# EasyEDA Pro project CSR8675_Mini_System.eprj

# Schematic Schematic1
Create Date: 2024-04-30; Page Name: P1; Project Name: CSR8675_Mini_System; Schematic Name: Schematic1; Update Date: 2024-04-30; Company: 嘉立创EDA; Page Size: A4; Version: V1.0
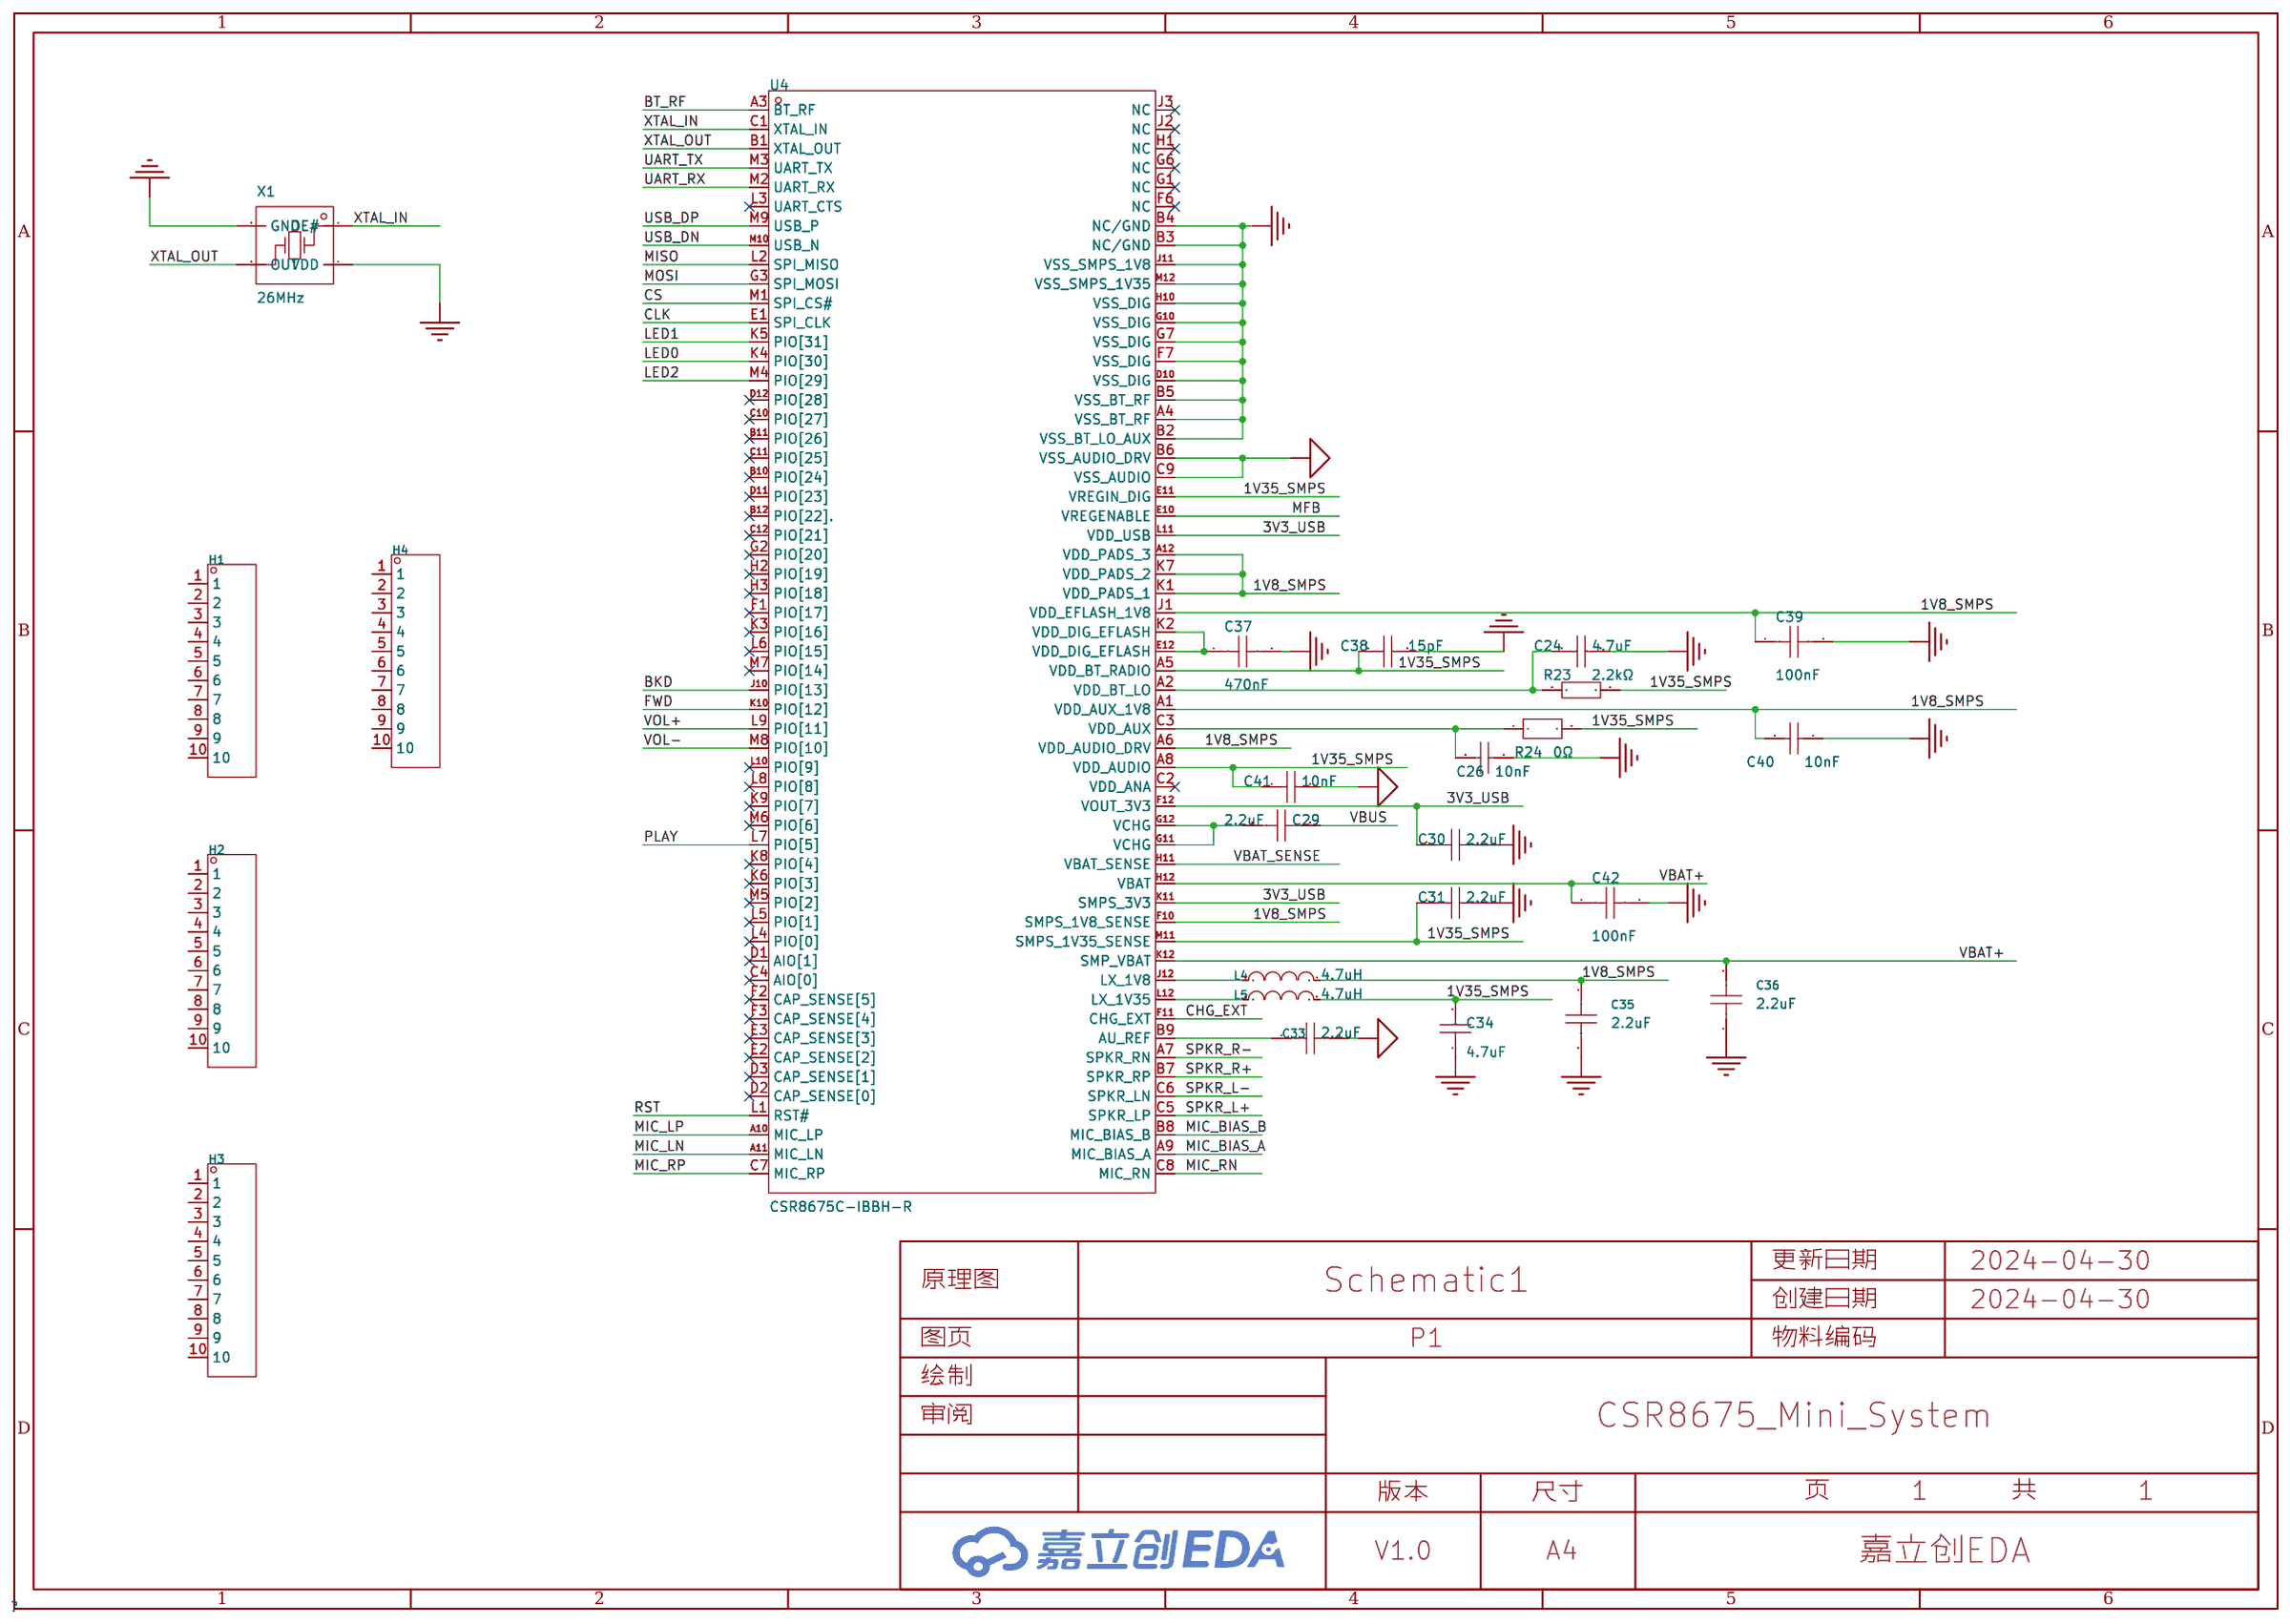
[diagram p0: schematic sheet]

## Parts
C24  4.7uF  [C0603]
C26  10nF  [C0603]
C29  2.2uF  [C0603]
C30  2.2uF  [C0603]
C31  2.2uF  [C0603]
C33  2.2uF  [C0603]
C34  4.7uF  [C0603]
C35  2.2uF  [C0603]
C36  2.2uF  [C0603]
C37  470nF  [C0402]
C38  15pF  [C0402]
C39  100nF  [C0402]
C40  10nF  [C0402]
C41  10nF  [C0402]
C42  100nF  [C0402]
H1  -  [HDR-TH_10P-P2.54-V-M-1]
H2  -  [HDR-TH_10P-P2.54-V-M-1]
H3  -  [HDR-TH_10P-P2.54-V-M-1]
H4  -  [HDR-TH_10P-P2.54-V-M-1]
L4  4.7uH  [L0805]
L5  4.7uH  [L0805]
R23  2.2kΩ  [R0402]
R24  0Ω  [R0402]
U4  CSR8675C-IBBH-R  [BGA-112_L6.5-W6.5-P0.50-TL]
X1  26MHz  [OSC-SMD_4P-L2.0-W1.6-BL_X201624MKB4SI]

## Library data of the parts
C24 = CL10A475KO8NNNC: 容值:4.7uF;精度:±10%;额定电压:16V;材质(温度系数):X5R;; LCSC Part Name: 4.7uF ±10% 16V; Supplier Part: C19666; Manufacturer: SAMSUNG(三星); Supplier Footprint: 0603; JLCPCB Part Class: 基础库; Datasheet: https://atta.szlcsc.com/upload/public/pdf/source/20160218/1457707763339.pdf; Supplier: LCSC; Tolerance: ±10%; Voltage Rated: 16V; Temperature Coefficient: X5R
C26 = CC0603KRX7R9BB103: 容值:10nF;精度:±10%;额定电压:50V;材质(温度系数):X7R;; LCSC Part Name: 10nF ±10% 50V; Supplier Part: C100042; Manufacturer: YAGEO(国巨); Supplier Footprint: 0603; JLCPCB Part Class: 扩展库; Datasheet: https://atta.szlcsc.com/upload/public/pdf/source/20181008/C309510_22F155564471FAF6A489F7D68F34234E.pdf; Supplier: LCSC; Tolerance: ±10%; Voltage Rated: 50V; Temperature Coefficient: X7R
C29-C31 = GRM21BD72A225KE01L: 容值:2.2uF;精度:±10%;额定电压:100V;材质(温度系数):X7T;; LCSC Part Name: 2.2uF ±10% 100V; Supplier Part: C2981733; Manufacturer: muRata(村田); Supplier Footprint: 0805; JLCPCB Part Class: 扩展库; Datasheet: https://atta.szlcsc.com/upload/public/pdf/source/20220321/E617CBC6A636009B84263A7C0F0B7534.pdf; Supplier: LCSC; Tolerance: ±10%; Voltage Rated: 100V; Temperature Coefficient: X7T
C33 C35 C36 = CL10A225KB8NNNC: 容值:2.2uF;精度:±10%;额定电压:50V;材质(温度系数):X5R;; LCSC Part Name: 2.2uF ±10% 50V; Supplier Part: C913904; Manufacturer: SAMSUNG(三星); Supplier Footprint: 0603; JLCPCB Part Class: 扩展库; Datasheet: https://atta.szlcsc.com/upload/public/pdf/source/20160218/1457707763339.pdf; Supplier: LCSC; Tolerance: ±10%; Voltage Rated: 50V; Temperature Coefficient: X5R
C34 = CL21A475KAQNNNE: 容值:4.7uF;精度:±10%;额定电压:25V;材质(温度系数):X5R;; LCSC Part Name: 4.7uF ±10% 25V; Supplier Part: C1779; Manufacturer: SAMSUNG(三星); Supplier Footprint: 0805; JLCPCB Part Class: 基础库; Datasheet: https://atta.szlcsc.com/upload/public/pdf/source/20160218/1457707763339.pdf; Supplier: LCSC; Tolerance: ±10%; Voltage Rated: 25V; Temperature Coefficient: X5R
C37 = GRM155R61H474KE11D: 容值:470nF;精度:±10%;额定电压:50V;材质(温度系数):X5R;; LCSC Part Name: 470nF ±10% 50V; Supplier Part: C437527; Manufacturer: muRata(村田); Supplier Footprint: 0402; JLCPCB Part Class: 扩展库; Datasheet: https://atta.szlcsc.com/upload/public/pdf/source/20191226/C475964_3FAF76C90CD8FFB09F50C7480ADA926F.pdf; Supplier: LCSC; Tolerance: ±10%; Voltage Rated: 50V; Temperature Coefficient: X5R
C38 = 0402CG150J500NT: 容值:15pF;精度:±5%;额定电压:50V;材质(温度系数):C0G;; LCSC Part Name: 15pF ±5% 50V; Supplier Part: C1548; Manufacturer: FH(风华); Supplier Footprint: 0402; JLCPCB Part Class: 基础库; Datasheet: https://atta.szlcsc.com/upload/public/pdf/source/20200305/C486355_26A10D38EF8C2A5C37091D0039909270.pdf; Supplier: LCSC; Tolerance: ±5%; Voltage Rated: 50V; Temperature Coefficient: C0G
C39 C42 = GRM155R71H104KE14D: 容值:100nF;精度:±10%;额定电压:50V;材质(温度系数):X7R;; LCSC Part Name: 100nF ±10% 50V; Supplier Part: C77020; Manufacturer: muRata(村田); Supplier Footprint: 0402; JLCPCB Part Class: 扩展库; Datasheet: https://atta.szlcsc.com/upload/public/pdf/source/20180326/C77020_39BD49C951FF1AF0DB1F1FAC5AC1E401.pdf; Supplier: LCSC; Tolerance: ±10%; Voltage Rated: 50V; Temperature Coefficient: X7R
C40 C41 = CC0402KRX7R9BB103: 容值:10nF;精度:±10%;额定电压:50V;材质(温度系数):X7R;; LCSC Part Name: 10nF ±10% 50V; Supplier Part: C60133; Manufacturer: YAGEO(国巨); Supplier Footprint: 0402; JLCPCB Part Class: 扩展库; Datasheet: https://atta.szlcsc.com/upload/public/pdf/source/20180224/C181747_15194369449651363981.pdf; Supplier: LCSC; Tolerance: ±10%; Voltage Rated: 50V; Temperature Coefficient: X7R
H1-H4 = HDR-M_2.54_1x10P: Supplier Part: C57369; Supplier Footprint: 插件
L4 L5 = LQM21PN4R7MGRD: 电感值:4.7uH;精度:±20%;额定电流:800mA;饱和电流(Isat):-;直流电阻(DCR):288mΩ;; LCSC Part Name: 4.7uH ±20%; Supplier Part: C86090; Manufacturer: muRata(村田); Supplier Footprint: 0805; JLCPCB Part Class: 扩展库; Datasheet: https://atta.szlcsc.com/upload/public/pdf/source/20180326/C86090_F1DCF4677DBA65EF9113FC7328EBFD0F.pdf; Supplier: LCSC; Tolerance: ±20%; Rated Current: 800mA; DC Resistance (DCR): 288mΩ; Frequency - Self Resonant: 30MHz
R23 = 0402WGF2201TCE: 电阻类型:厚膜电阻;阻值:2.2kΩ;精度:±1%;功率:62.5mW;最大工作电压:50V;温度系数:±100ppm/℃;; LCSC Part Name: 2.2kΩ ±1% 62.5mW 厚膜电阻; Supplier Part: C25879; Manufacturer: UNI-ROYAL(厚声); Supplier Footprint: 0402; JLCPCB Part Class: 基础库; Datasheet: https://atta.szlcsc.com/upload/public/pdf/source/20200306/C422600_1E6D84923E4A46A82E41ADD87F860B5C.pdf; Supplier: LCSC; Type: 厚膜电阻; Tolerance: ±1%; Power(Watts): 62.5mW; Overload Voltage (Max): 50V; Temperature Coefficient: ±100ppm/℃; Operating Temperature Range: -55℃~+155℃
R24 = FRC0402F0000TS: 电阻类型:厚膜电阻;阻值:0Ω;精度:±1%;功率:62.5mW;最大工作电压:50V;; LCSC Part Name: 0Ω ±1% 62.5mW 厚膜电阻; Supplier Part: C2906858; Manufacturer: FOJAN(富捷); Supplier Footprint: 0402; JLCPCB Part Class: 扩展库; Datasheet: https://atta.szlcsc.com/upload/public/pdf/source/20211221/925EC7D7225764EE0046F22065062C87.pdf; Supplier: LCSC; Type: 厚膜电阻; Tolerance: ±1%; Power(Watts): 62.5mW; Overload Voltage (Max): 50V; Operating Temperature Range: -55℃~+155℃
U4 = CSR8675C-IBBH-R: 频率范围:2.4GHz;接口:I2S;应用领域:蓝牙;灵敏度:-90dBm;; Supplier Part: C3606593; Manufacturer: Qualcomm; Supplier Footprint: VFBGA-112; JLCPCB Part Class: 扩展库; Supplier: LCSC; Frequency Range: 2.4GHz; Interface: I2S; Operating Voltage: 3.3V; Applications: 蓝牙; Output Power: 10dBm; Sensitivity: -90dBm
X1 = OT201626MJBA4SL: 频率:26MHz;工作电压:1.8V~3.3V;供电电流:4mA;频率稳定度(全温):±10ppm;; LCSC Part Name: 26MHz ±10ppm 1.8V~3.3V YSO110TR; Supplier Part: C669081; Manufacturer: YXC(扬兴晶振); Supplier Footprint: SMD2016-4P; JLCPCB Part Class: 扩展库; Datasheet: https://atta.szlcsc.com/upload/public/pdf/source/20210329/C669065_30B18CFE780D377BA4E84F6ED1951959.pdf; Supplier: LCSC; Supply Voltage: 1.8V~3.3V; Supply Current (Max): 4mA; Frequency Stability(Full temperature range): ±10ppm; Operating Temperature: -40℃~+85℃

## Nets
1V8_SMPS: C35.1 C39.1 C40.1 L4.2 U4.A1(VDD_AUX_1V8) U4.A6(VDD_AUDIO_DRV) U4.A12(VDD_PADS_3) U4.F10(SMPS_1V8_SENSE) U4.J1(VDD_EFLASH_1V8) U4.K1(VDD_PADS_1) U4.K7(VDD_PADS_2)
1V35_SMPS: C31.1 C34.2 C38.1 C41.1 L5.2 R23.2 R24.2 U4.A5(VDD_BT_RADIO) U4.A8(VDD_AUDIO) U4.E11(VREGIN_DIG) U4.M11(SMPS_1V35_SENSE)
3V3_USB: C30.1 U4.F12(VOUT_3V3) U4.K11(SMPS_3V3) U4.L11(VDD_USB)
AGND: C33.2 C41.2 U4.B6(VSS_AUDIO_DRV) U4.C9(VSS_AUDIO)
GND: C24.2 C26.1 C30.2 C31.2 C34.1 C35.2 C36.1 C37.2 C38.2 C39.2 C40.2 C42.2 U4.A4(VSS_BT_RF) U4.B2(VSS_BT_LO_AUX) U4.B3(NC/GND) U4.B4(NC/GND) U4.B5(VSS_BT_RF) U4.D10(VSS_DIG) U4.F7(VSS_DIG) U4.G7(VSS_DIG) U4.G10(VSS_DIG) U4.H10(VSS_DIG) U4.J11(VSS_SMPS_1V8) U4.M12(VSS_SMPS_1V35) X1.2(GND) X1.4(VDD)
VBAT+: C36.2 C42.1 U4.H12(VBAT) U4.K12(SMP_VBAT)
VBAT_SENSE: U4.H11(VBAT_SENSE)
VBUS: C29.2
BKD: U4.J10(PIO[13])
BT_RF: U4.A3(BT_RF)
CHG_EXT: U4.F11(CHG_EXT)
CLK: U4.E1(SPI_CLK)
CS: U4.M1(SPI_CS#)
FWD: U4.K10(PIO[12])
LED0: U4.K4(PIO[30])
LED1: U4.K5(PIO[31])
LED2: U4.M4(PIO[29])
MFB: U4.E10(VREGENABLE)
MIC_BIAS_A: U4.A9(MIC_BIAS_A)
MIC_BIAS_B: U4.B8(MIC_BIAS_B)
MIC_LN: U4.A11(MIC_LN)
MIC_LP: U4.A10(MIC_LP)
MIC_RN: U4.C8(MIC_RN)
MIC_RP: U4.C7(MIC_RP)
MISO: U4.L2(SPI_MISO)
MOSI: U4.G3(SPI_MOSI)
PLAY: U4.L7(PIO[5])
RST: U4.L1(RST#)
SPKR_L+: U4.C5(SPKR_LP)
SPKR_L-: U4.C6(SPKR_LN)
SPKR_R+: U4.B7(SPKR_RP)
SPKR_R-: U4.A7(SPKR_RN)
UART_RX: U4.M2(UART_RX)
UART_TX: U4.M3(UART_TX)
USB_DN: U4.M10(USB_N)
USB_DP: U4.M9(USB_P)
VOL+: U4.L9(PIO[11])
VOL-: U4.M8(PIO[10])
XTAL_IN: U4.C1(XTAL_IN) X1.1(OE#)
XTAL_OUT: U4.B1(XTAL_OUT) X1.3(OUT)
$1N1302: C29.1 U4.G11(VCHG) U4.G12(VCHG)
$1N1310: L4.1 U4.J12(LX_1V8)
$1N1325: C26.2 R24.1 U4.C3(VDD_AUX)
$1N1328: L5.1 U4.L12(LX_1V35)
$1N1332: C24.1 R23.1 U4.A2(VDD_BT_LO)
$1N1345: C37.1 U4.E12(VDD_DIG_EFLASH) U4.K2(VDD_DIG_EFLASH)
$1N1388: C33.1 U4.B9(AU_REF)

Not connected (* = marked no-connect by the designer): H1 1 2 3 4 5 6 7 8 9 10; H2 1 2 3 4 5 6 7 8 9 10; H3 1 2 3 4 5 6 7 8 9 10; H4 1 2 3 4 5 6 7 8 9 10; U4 B10(PIO[24])* B11(PIO[26])* B12(PIO[22].)* C2(VDD_ANA)* C4(AIO[0])* C10(PIO[27])* C11(PIO[25])* C12(PIO[21])* D1(AIO[1])* D2(CAP_SENSE[0])* D3(CAP_SENSE[1])* D11(PIO[23])* D12(PIO[28])* E2(CAP_SENSE[2])* E3(CAP_SENSE[3])* F1(PIO[17])* F2(CAP_SENSE[5])* F3(CAP_SENSE[4])* F6(NC)* G1(NC)* G2(PIO[20])* G6(NC)* H1(NC)* H2(PIO[19])* H3(PIO[18])* J2(NC)* J3(NC)* K3(PIO[16])* K6(PIO[3])* K8(PIO[4])* K9(PIO[7])* L3(UART_CTS)* L4(PIO[0])* L5(PIO[1])* L6(PIO[15])* L8(PIO[8])* L10(PIO[9])* M5(PIO[2])* M6(PIO[6])* M7(PIO[14])*

# Board PCB1
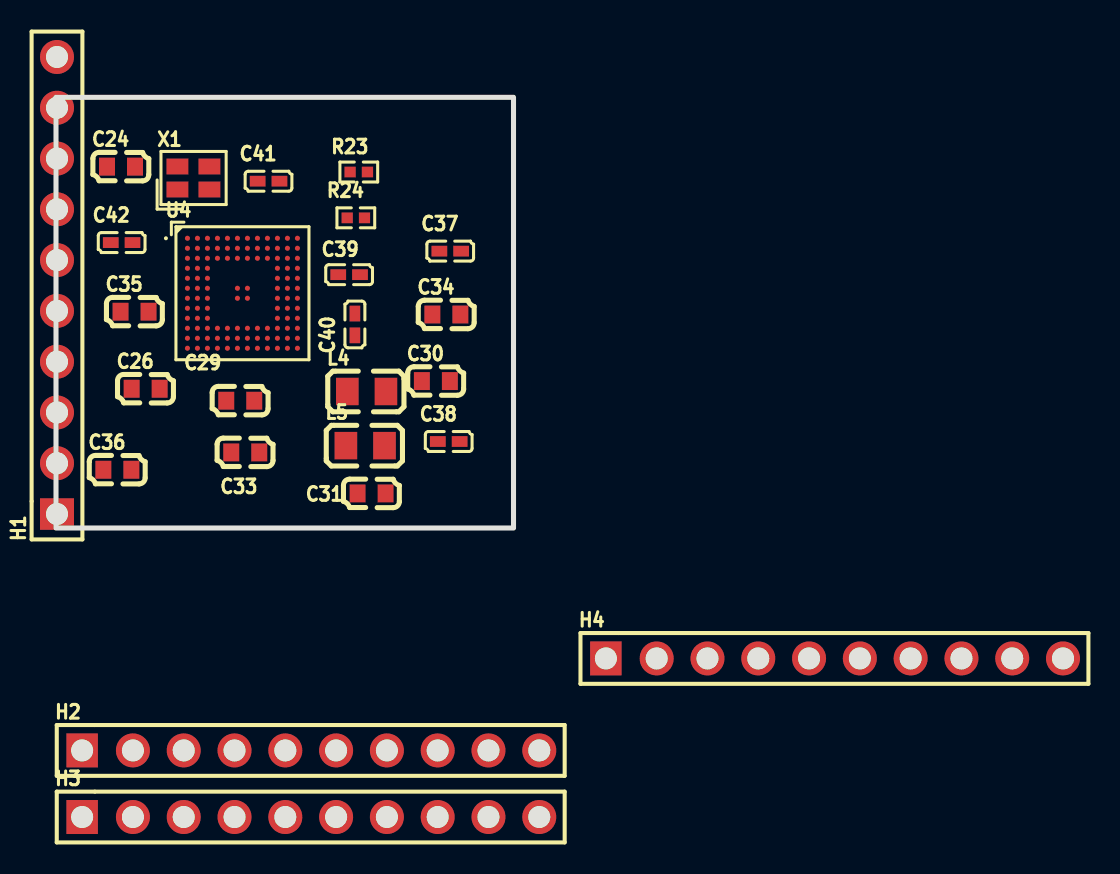
[diagram p1: board, top side]
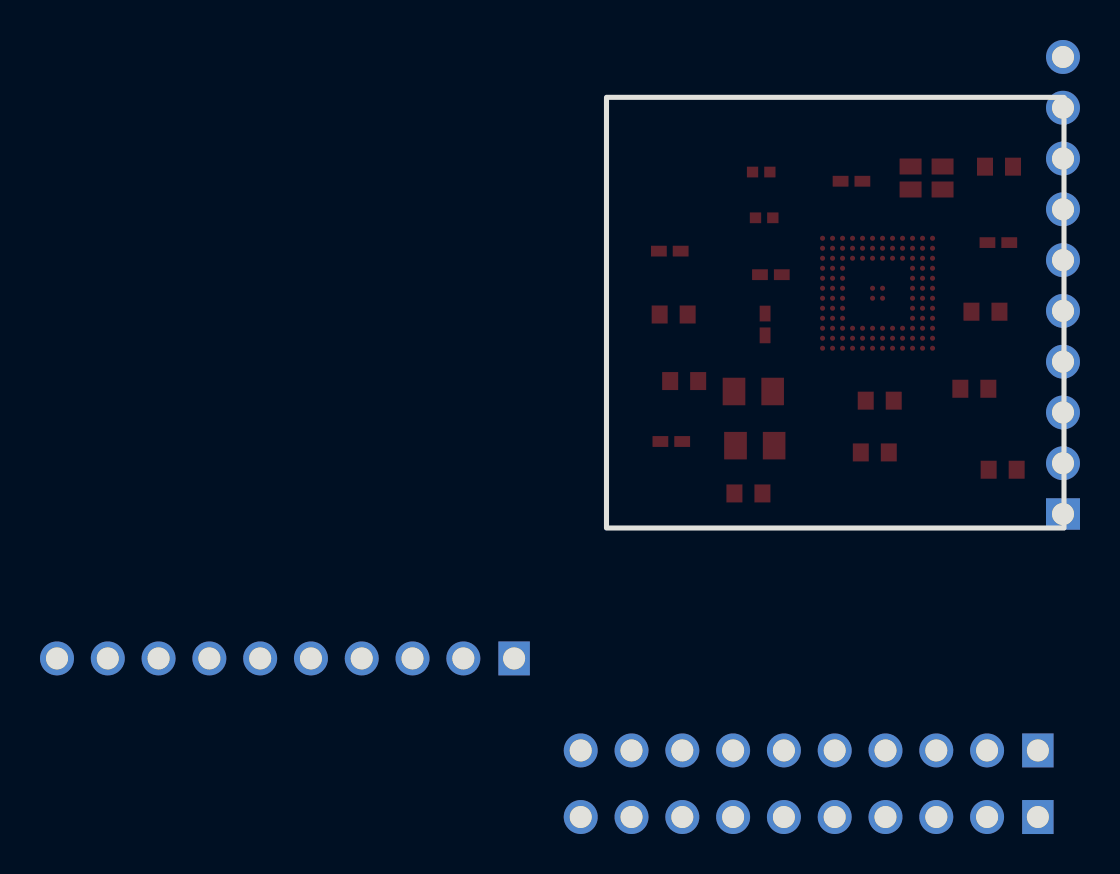
[diagram p2: board, bottom side, seen from below]

Outline 22.88 x 21.54 mm; copper layers: Top Layer, Bottom Layer. Coordinates in mm from the lower left corner of the outline.
Outline path: rectangle 0,21.54 22.88,0
Stack: Top Layer 0.035mm / Dielectric1 1.51mm FR4 er 4.5 / Bottom Layer 0.035mm

## Design rules (mm)
template: JLCPCB Capability(Two Layers Board)
spacing copperThickness1oz (default): track to track 0.102, other pairs 0.152 to 0.3
spacing copperThickness2oz: track to track 0.203, other pairs 0.152 to 0.3
track width copperThickness1oz (default): min 0.127, default 0.254, max 2.54
track width copperThickness2oz: min 0.203, default 0.254, max 2.54
differential pair differentialPair (default): width min 0.127, default 0.254, max 2.54; gap min 0.152, default 0.152
via viaSize (default): diameter min 0.5, default 0.61, max 10; hole min 0.3, default 0.305, max 6.3

## Placement (name value [footprint] x y rotation side)
C24  4.7uF  [C0603]  3.25 18.07 0 top
C26  10nF  [C0603]  4.48 6.96 0 top
C29  2.2uF  [C0603]  9.21 6.37 0 top
C30  2.2uF  [C0603]  18.99 7.35 0 top
C31  2.2uF  [C0603]  15.78 1.73 0 top
C33  2.2uF  [C0603]  9.46 3.78 0 top
C34  4.7uF  [C0603]  19.52 10.68 0 top
C35  2.2uF  [C0603]  3.93 10.82 0 top
C36  2.2uF  [C0603]  3.07 2.91 0 top
C37  470nF  [C0402]  19.71 13.85 0 top
C38  15pF  [C0402]  19.64 4.33 0 top
C39  100nF  [C0402]  14.66 12.67 0 top
C40  10nF  [C0402]  14.95 10.18 90 top
C41  10nF  [C0402]  10.63 17.34 0 top
C42  100nF  [C0402]  3.28 14.28 0 top
H1  -  [HDR-TH_10P-P2.54-V-M-1]  0.05 12.13 90 top
H2  -  [HDR-TH_10P-P2.54-V-M-1]  12.74 -11.13 0 top
H3  -  [HDR-TH_10P-P2.54-V-M-1]  12.74 -14.46 0 top
H4  -  [HDR-TH_10P-P2.54-V-M-1]  38.93 -6.52 0 top
L4  4.7uH  [L0805]  15.54 6.83 0 top
L5  4.7uH  [L0805]  15.46 4.12 0 top
R23  2.2kΩ  [R0402]  15.14 17.8 0 top
R24  0Ω  [R0402]  14.99 15.51 0 top
U4  CSR8675C-IBBH-R  [BGA-112_L6.5-W6.5-P0.50-TL]  9.32 11.74 0 top
X1  26MHz  [OSC-SMD_4P-L2.0-W1.6-BL_X201624MKB4SI]  6.87 17.51 0 top

## Footprints (pads in the part's own frame, mm; a bottom-side part is the same pattern mirrored in y, then rotated)
BGA-112_L6.5-W6.5-P0.50-TL
  round 0.256 smd: A1(-2.75,2.75) A2(-2.25,2.75) A3(-1.75,2.75) A4(-1.25,2.75) A5(-0.75,2.75) A6(-0.25,2.75) A7(0.25,2.75) A8(0.75,2.75) A9(1.25,2.75) A10(1.75,2.75) A11(2.25,2.75) A12(2.75,2.75) B1(-2.75,2.25) B2(-2.25,2.25) B3(-1.75,2.25) B4(-1.25,2.25) B5(-0.75,2.25) B6(-0.25,2.25) B7(0.25,2.25) B8(0.75,2.25) B9(1.25,2.25) B10(1.75,2.25) B11(2.25,2.25) B12(2.75,2.25) C1(-2.75,1.75) C2(-2.25,1.75) C3(-1.75,1.75) C4(-1.25,1.75) C5(-0.75,1.75) C6(-0.25,1.75) C7(0.25,1.75) C8(0.75,1.75) C9(1.25,1.75) C10(1.75,1.75) C11(2.25,1.75) C12(2.75,1.75) D1(-2.75,1.25) D2(-2.25,1.25) D3(-1.75,1.25) D10(1.75,1.25) D11(2.25,1.25) D12(2.75,1.25) E1(-2.75,0.75) E2(-2.25,0.75) E3(-1.75,0.75) E10(1.75,0.75) E11(2.25,0.75) E12(2.75,0.75) F1(-2.75,0.25) F2(-2.25,0.25) F3(-1.75,0.25) F6(-0.25,0.25) F7(0.25,0.25) F10(1.75,0.25) F11(2.25,0.25) F12(2.75,0.25) G1(-2.75,-0.25) G2(-2.25,-0.25) G3(-1.75,-0.25) G6(-0.25,-0.25) G7(0.25,-0.25) G10(1.75,-0.25) G11(2.25,-0.25) G12(2.75,-0.25) H1(-2.75,-0.75) H2(-2.25,-0.75) H3(-1.75,-0.75) H10(1.75,-0.75) H11(2.25,-0.75) H12(2.75,-0.75) J1(-2.75,-1.25) J2(-2.25,-1.25) J3(-1.75,-1.25) J10(1.75,-1.25) J11(2.25,-1.25) J12(2.75,-1.25) K1(-2.75,-1.75) K2(-2.25,-1.75) K3(-1.75,-1.75) K4(-1.25,-1.75) K5(-0.75,-1.75) K6(-0.25,-1.75) K7(0.25,-1.75) K8(0.75,-1.75) K9(1.25,-1.75) K10(1.75,-1.75) K11(2.25,-1.75) K12(2.75,-1.75) L1(-2.75,-2.25) L2(-2.25,-2.25) L3(-1.75,-2.25) L4(-1.25,-2.25) L5(-0.75,-2.25) L6(-0.25,-2.25) L7(0.25,-2.25) L8(0.75,-2.25) L9(1.25,-2.25) L10(1.75,-2.25) L11(2.25,-2.25) L12(2.75,-2.25) M1(-2.75,-2.75) M2(-2.25,-2.75) M3(-1.75,-2.75) M4(-1.25,-2.75) M5(-0.75,-2.75) M6(-0.25,-2.75) M7(0.25,-2.75) M8(0.75,-2.75) M9(1.25,-2.75) M10(1.75,-2.75) M11(2.25,-2.75) M12(2.75,-2.75)
C0402
  rect 0.79x0.54 smd: 1(-0.545,0) 2(0.545,0)
C0603
  rect 0.8x0.9 smd: 1(-0.7,0) 2(0.7,0)
HDR-TH_10P-P2.54-V-M-1
  rect 1.575x1.7 hole 1.1: 1(-11.43,0)
  round 1.7 hole 1.1: 2(-8.89,0) 3(-6.35,0) 4(-3.81,0) 5(-1.27,0) 6(1.27,0) 7(3.81,0) 8(6.35,0) 9(8.89,0) 10(11.43,0)
L0805
  rect 1.133x1.377 smd: 1(-0.966,0) 2(0.966,0)
OSC-SMD_4P-L2.0-W1.6-BL_X201624MKB4SI
  rect 1.1x0.8 smd: 1(-0.8,-0.575) 2(0.8,-0.575) 3(0.8,0.575) 4(-0.8,0.575)
R0402
  rect 0.566x0.54 smd: 1(-0.433,0) 2(0.433,0)

## Nets
As in the schematic.

Pads without a net: H1 1 2 3 4 5 6 7 8 9 10; H2 1 2 3 4 5 6 7 8 9 10; H3 1 2 3 4 5 6 7 8 9 10; H4 1 2 3 4 5 6 7 8 9 10; U4 B10 B11 B12 C2 C4 C10 C11 C12 D1 D2 D3 D11 D12 E2 E3 F1 F2 F3 F6 G1 G2 G6 H1 H2 H3 J2 J3 K3 K6 K8 K9 L3 L4 L5 L6 L8 L10 M5 M6 M7
